# Altium schematic sheet Template A3.SchDoc
size 393 x 281 mm
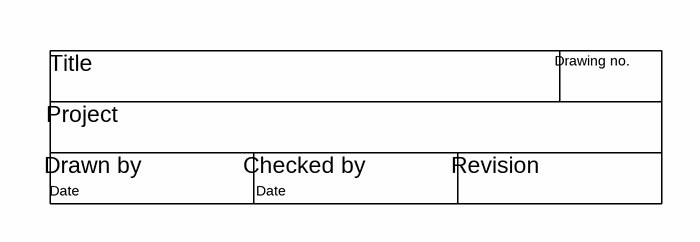
[diagram p0: Template A3.SchDoc]

## Notes on the sheet
- Title
- Project
- Drawing no.
- Date
- Drawn by
- Checked by
- Revision